# Altium schematic sheet SNES TST Sheet5.SchDoc: SNES TST
size A4; DrawnBy: Opatus; Revision: 0; SheetNumber: 5; SheetTotal: 5
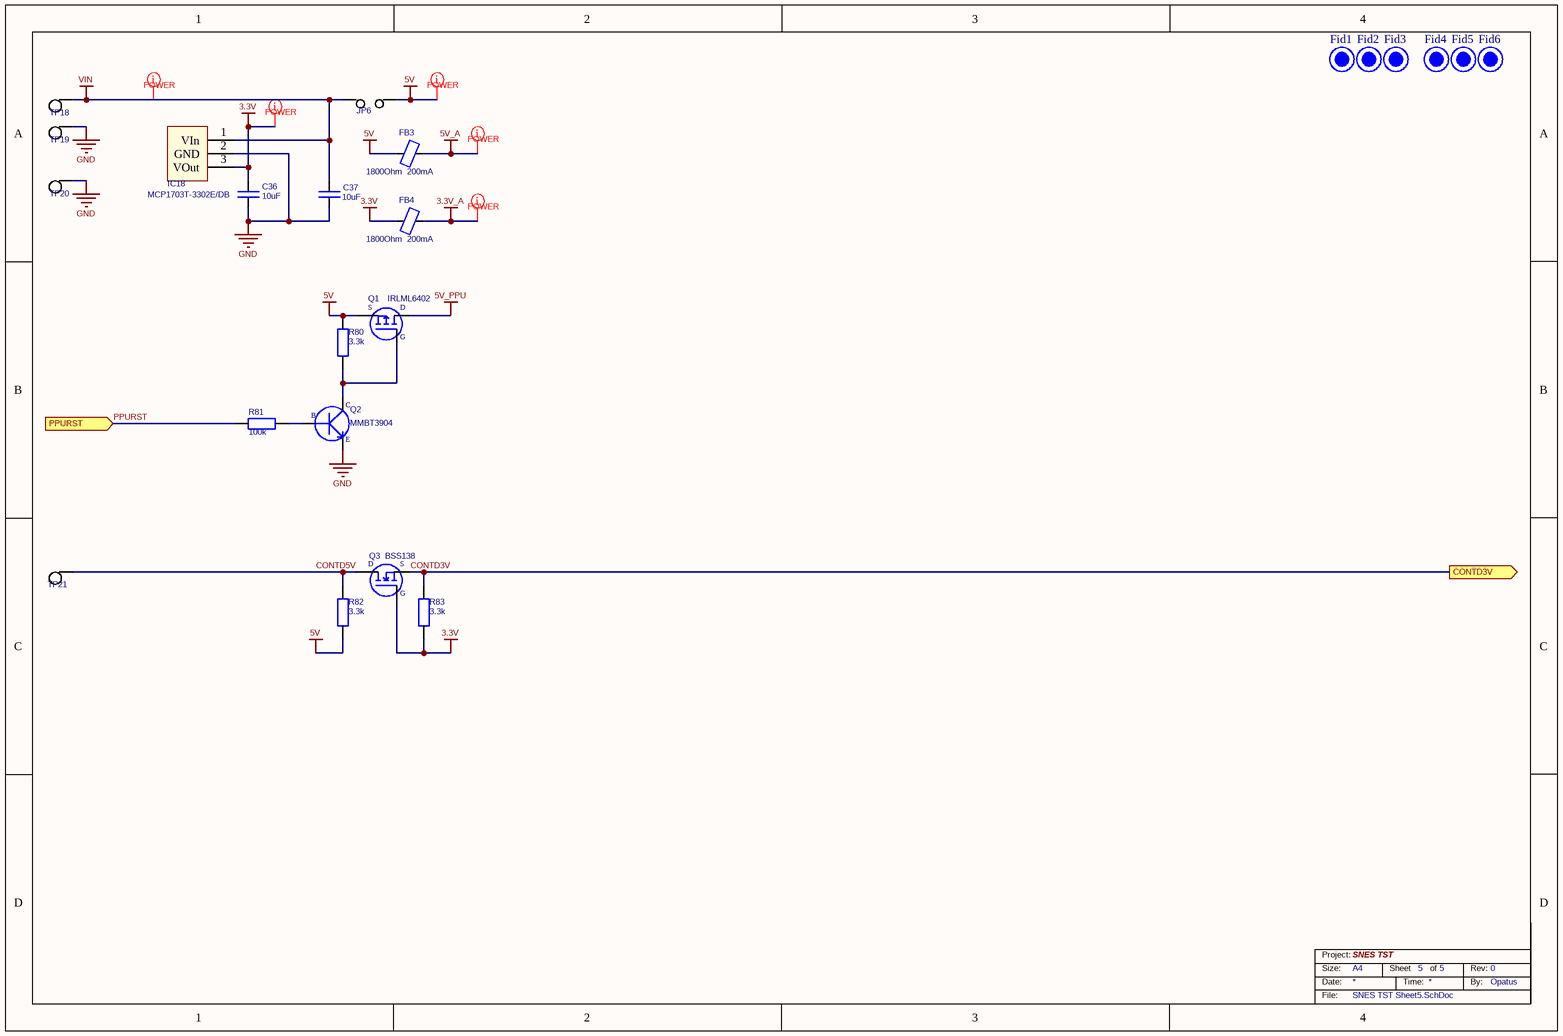
[diagram p0: SNES TST Sheet5.SchDoc]

## Parts
C36  10uF  [Cap_0805_Chip]
C37  10uF  [Cap_1206_Chip]
FB3  1800Ohm  200mA  [Ind_0402_Chip]
FB4  1800Ohm  200mA  [Ind_0402_Chip]
Fid1  Fiducial  [Fiducial_1_side]  (value not drawn)  (no BOM)
Fid2  Fiducial  [Fiducial_1_side]  (value not drawn)  (no BOM)
Fid3  Fiducial  [Fiducial_1_side]  (value not drawn)  (no BOM)
Fid4  Fiducial  [Fiducial_1_side]  (value not drawn)  (no BOM)
Fid5  Fiducial  [Fiducial_1_side]  (value not drawn)  (no BOM)
Fid6  Fiducial  [Fiducial_1_side]  (value not drawn)  (no BOM)
IC18  Manufacturer_Part_Number: MCP1703T-3302E/DB  [SOT223-3]  (hidden comment: MCP1703T)
JP6  Jumper  [Jumper Big]  (value not drawn)  (no BOM)
Q1  IRLML6402  [SOT23_FET]
Q2  MMBT3904  [SOT23_Transistor]
Q3  BSS138  [SOT23_FET]
R80  3.3k  [Res_0402_Chip]
R81  100k  [Res_0402_Chip]
R82  3.3k  [Res_0402_Chip]
R83  3.3k  [Res_0402_Chip]
TP18  Pin Connector  [Pin Connector Small]  (value not drawn)  (no BOM)
TP19  Pin Connector  [Pin Connector Small]  (value not drawn)  (no BOM)
TP20  Pin Connector  [Pin Connector Small]  (value not drawn)  (no BOM)
TP21  Pin Connector  [Pin Connector Small]  (value not drawn)  (no BOM)

## Ports
CONTD3V (out), PPURST (in)

## Nets
3.3V: C36.2 FB4.1 IC18.3(VOut) Q3.G R83.2
3.3V_A: FB4.2
5V: FB3.1 JP6.1 Q1.S R80.1 R82.2
5V_A: FB3.2
5V_PPU: Q1.D
GND: C36.1 C37.1 IC18.2(GND) Q2.E TP19.1 TP20.1
VIN: C37.2 IC18.1(VIn) JP6.2 TP18.1
CONTD3V: Q3.S R83.1 ; port CONTD3V
CONTD5V: Q3.D R82.1 TP21.1
PPURST: R81.1 ; port PPURST
NetQ1_G: Q1.G Q2.C R80.2
NetQ2_B: Q2.B R81.2

## Layout directives
net class POWER: 3.3V, 3.3V_A, 5V, 5V_A, VIN

## Notes on the sheet
- Size:
- Date:
- Project:
- A4
- Sheet
- Time:
- of
- Rev:
- By:
- File:

## Library data of the parts
C36 = Capacitor: Nominal Voltage: 10V; Dielectric: X7R; Tolerance: +-20%; Value: 10uF
C37 = Capacitor: Nominal Voltage: 25V; Dielectric: X7R; Tolerance: +-20%; Value: 10uF
FB3 FB4 = Ferrite Bead: Manufacturer_Part_Number: MMZ1005S182ET000; Vendor: TDK; Value: 1800Ohm  200mA
IC18 = MCP1703 SOT223: 3.3V Regulator; Vendor: Microchip
Q1 = Mosfet1: Vendor: Diodes; Manufacturer_Part_Number: IRLML6402
Q2 = T_NPN: Vendor: Diodes; Manufacturer_Part_Number: MMBT3904
Q3 = Mosfet N: Vendor: Infenion; Manufacturer_Part_Number: BSS138
R80-R83 = R: Tolerance: +-1%
  R80 R82 R83: Value: 3.3k
  R81: Value: 100k